# EAGLE design rev-tank-preamp (EAGLE 6.5.0)
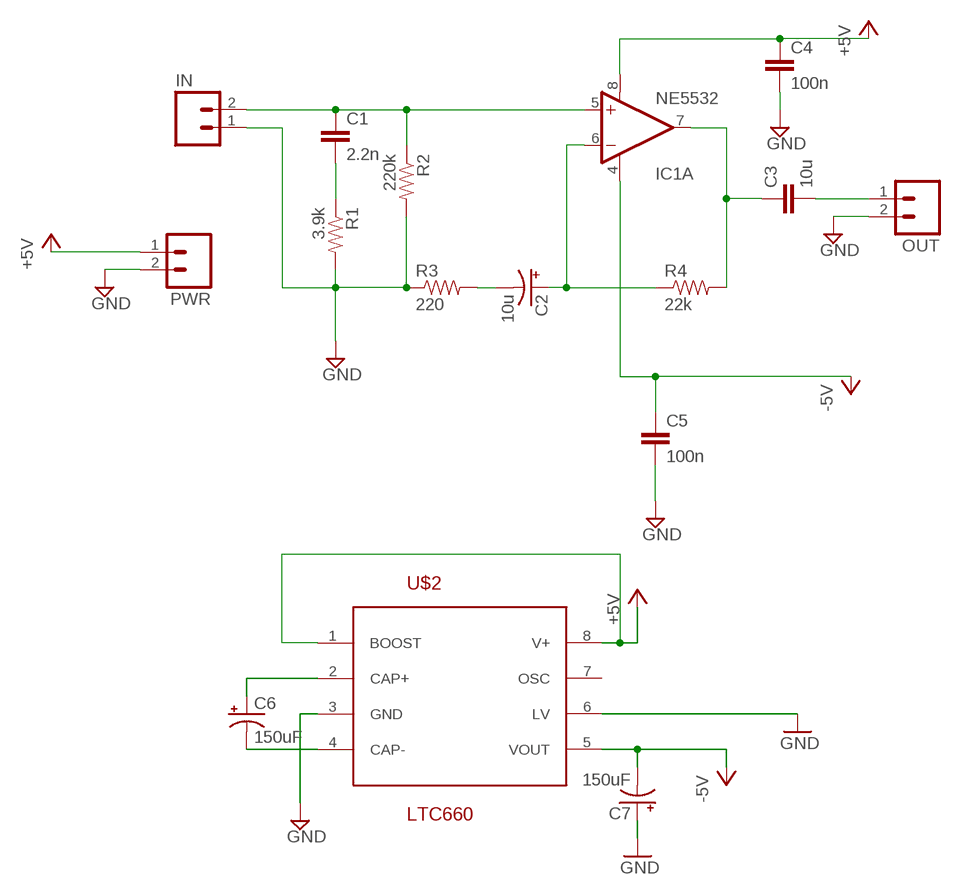
[diagram p0: schematic, sheet 1]

## Parts
C1  2.2n  CAPPTH1  [CAP-PTH-5MM]
C2  10u  CAP_POLPTH2  [CPOL-RADIAL-10UF-25V]
C3  10u  CAPPTH1  [CAP-PTH-5MM]
C4  100n  CAPPTH1  [CAP-PTH-5MM]
C5  100n  CAPPTH1  [CAP-PTH-5MM]
C6  150uF  CAP_POLPTH1  [CPOL-RADIAL-100UF-25V]
C7  150uF  CAP_POLPTH1  [CPOL-RADIAL-100UF-25V]
IC1  NE5532  OPAMP-DUALDIP  [DIP08]
IN  M02PTH  [1X02]
OUT  M02PTH  [1X02]
PWR  M02PTH  [1X02]
R1  3.9k  RESISTORPTH-1/6W  [1/6W-RES]
R2  220k  RESISTORPTH-1/6W  [1/6W-RES]
R3  220  RESISTORPTH-1/6W  [1/6W-RES]
R4  22k  RESISTORPTH-1/6W  [1/6W-RES]
U$2  LTC660  [SO08]

## Nets
+5V: C4.1 IC1.8(A:V+) PWR.1 U$2.1(BOOST) U$2.8(V+)
-5V: C5.1 C7.2(-) IC1.4(A:V-) U$2.5(VOUT)
GND: C4.2 C5.2 C7.1(+) IN.1 OUT.2 PWR.2 R1.2 R2.2 R3.1 U$2.3(GND) U$2.6(LV)
N$1: C1.1 IC1.5(A:+IN) IN.2 R2.1
N$2: C1.2 R1.1
N$3: C6.1(+) U$2.2(CAP+)
N$4: C2.1(+) IC1.6(A:-IN) R4.1
N$5: C2.2(-) R3.2
N$6: C3.2 OUT.1
N$7: C6.2(-) U$2.4(CAP-)
N$8: C3.1 IC1.7(A:OUT) R4.2
Unconnected: IC1.1(B:+IN) IC1.2(B:-IN) IC1.3(B:OUT) U$2.7(OSC)

## Library data of the parts
C1 C3-C5 = SparkFun:CAP: Capacitor Standard 0603 ceramic capacitor, and 0.1" leaded capacitor.
C2 C6 C7 = SparkFun:CAP_POL: Capacitor Polarized These are standard SMD and PTH capacitors. Normally 10uF, 47uF, and 100uF in electrolytic and tantalum varieties. Always verify the external diameter of the through hole cap, it varies with capacity, voltage, and manufacturer. The EIA devices should be standard.
IC1 = aliEagleLib:OPAMP-DUAL: Operational Amplifier
IN OUT PWR = SparkFun:M02: Header 2 Standard 2-pin 0.1" header. Use with straight break away headers (SKU : PRT-00116), right angle break away headers (PRT-00553), swiss pins (PRT-00743), machine pins (PRT-00117), and female headers (PRT-00115). Molex polarized connector foot print use with SKU : PRT-08233 with associated crimp pins and housings.
R1-R4 = SparkFun:RESISTOR: Resistor Basic schematic elements and footprints for 0603, 1206, and PTH resistors.
U$2 = Rays:LTC660

## Net classes
0 default: width 0.152 mm, clearance 0.152 mm

## Board
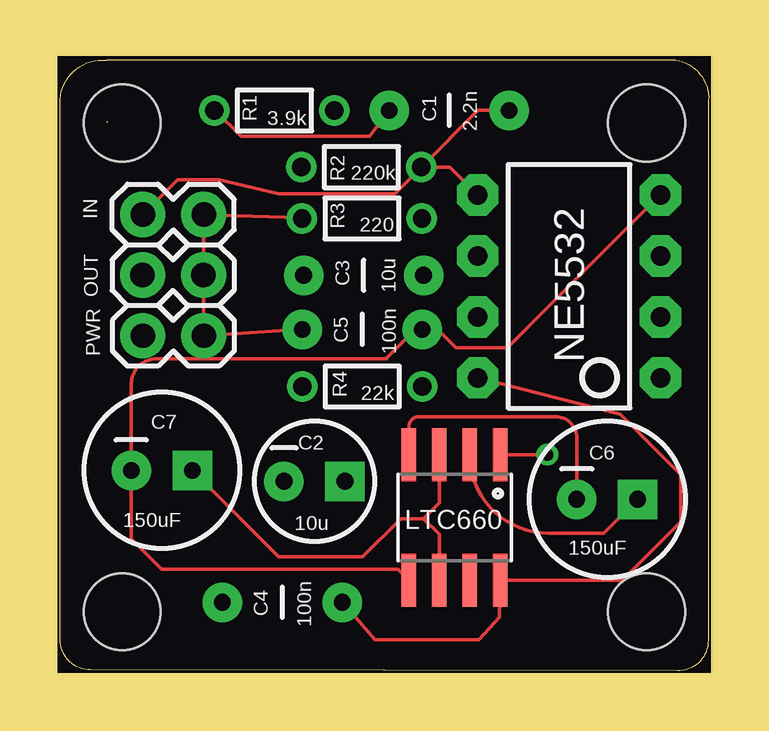
[diagram p1: board, top side]
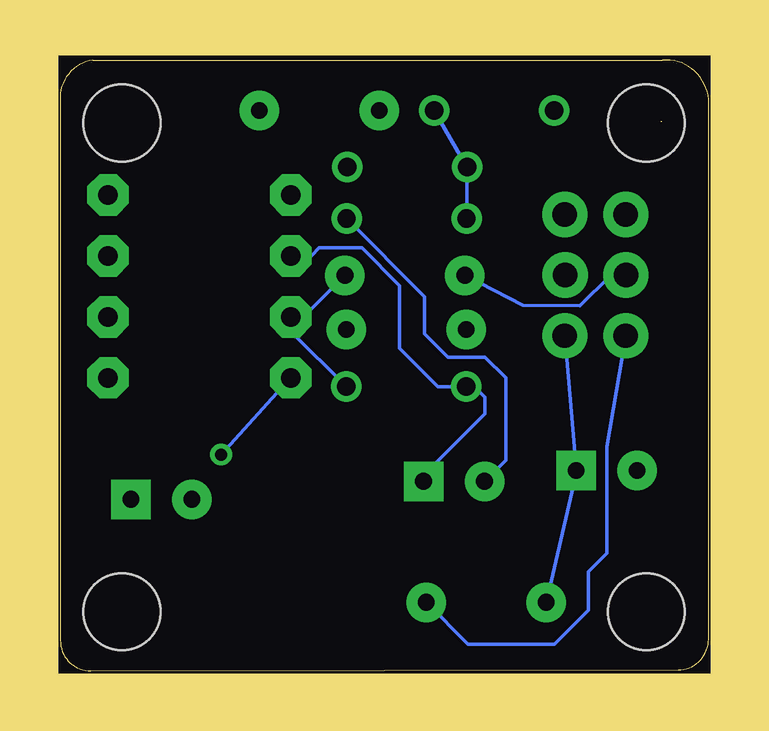
[diagram p2: board, bottom side, seen from below]

Size 27.04 x 25.46 mm. Coordinates in mm from the lower left corner, seen from the top.
Outline: 1.96,22.89 1.98,22.89
Outline: 25.68,25.45 1.93,25.45 arc90 0,23.82 0,1.32 arc90 1.27,0.05 25.76,0 arc90 27.03,1.27 27.03,23.62 arc90 25.68,25.45
Copper layers (1*16): Top 0.035mm / dielectric 1.5mm / Bottom 0.035mm
Design rules "default *": minimum track width 6mil, minimum drill 24mil, track to track 6mil, track to pad 6mil, pad to pad 6mil, via to via 6mil, smd to smd 6mil, copper to edge 0mil, drill to drill 8mil, minimum pad ring 10mil, minimum via ring 8mil, stop-mask expansion 4mil, vias tented up to drill 0mil, thermal gap 10mil
Holes 3.2 mm at 24.46,2.46 2.59,22.83 2.59,2.46 24.46,22.83
Milling: 4 lines

### Footprints (pad centres in the part's own frame; a part is rotated, then mirrored left to right if it is on the bottom)
CAP-PTH-5MM = drill 0.7 pad 1.651: 1 -2.5,0; 2 2.5,0
CPOL-RADIAL-10UF-25V = drill 0.7 pad 1.651 square: 1 1.27,0 | drill 0.7 pad 1.651: 2 -1.27,0
CPOL-RADIAL-100UF-25V = drill 0.7 pad 1.651 square: 1 1.27,0 | drill 0.7 pad 1.651: 2 -1.27,0
DIP08 = drill 0.813 pad 1.727 octagon: 1 -3.81,-3.81; 2 -1.27,-3.81; 3 1.27,-3.81; 4 3.81,-3.81; 5 3.81,3.81; 6 1.27,3.81; 7 -1.27,3.81; 8 -3.81,3.81
1X02 = drill 1.016 pad 1.88: 1 0,0; 2 2.54,0
1/6W-RES = drill 0.762: 1 -2.5,0; 2 2.5,0
SO08 = smd 0.61 x 2.21: 1 -1.905,-2.616; 2 -0.635,-2.616; 3 0.635,-2.616; 4 1.905,-2.616; 5 1.905,2.616; 6 0.635,2.616; 7 -0.635,2.616; 8 -1.905,2.616

### Placement (x,y rotation side)
C1  16.23,23.36 180 top
C2  10.61,7.9 0 top
C3  12.66,16.48 180 top
C4  9.27,2.86 180 top
C5  12.6,14.23 180 top
C6  22.82,7.15 0 top
C7  4.25,8.36 0 top
IC1  21.23,16.03 90 top
IN  5.99,19.02 180 top
OUT  3.44,16.5 0 top
PWR  3.45,13.97 0 top
R1  8.94,23.36 0 top
R2  12.57,20.99 180 top
R3  12.59,18.85 0 top
R4  12.6,11.85 0 top
U$2  16.45,6.4 180 top

### Tracks (layer width: path | path; a pad name or v marks a point on that pad's centre or on a via)
+5V  (via drill 0.5 pad 0.25)
  Top 0.152: C4.1 13.13,1.29 17.47,1.29 18.33,2.23 U$2.8 23.44,3.79 25.88,6.22 25.88,8.18 23.37,10.69 IC1.8 | v20.32,9.02 U$2.1
  Bottom 0.152: C4.1 10.03,1.12 6.43,1.12 5,2.54 5,4.14 4.24,4.91 4.24,9.35 PWR.1 | IC1.8 v20.32,9.02
-5V
  Top 0.152: IC1.4 18.66,13.46 16.51,13.46 15.74,14.23 C5.1 14.81,14.23 13.61,13.03 arc-90 13.59,13.01 4.01,13.01 arc90 2.98,11.97 C7.2 2.98,5.5 4.24,4.24 14.09,4.24 U$2.5
GND  (via drill 0.6)
  Top 0.152: U$2.6 15.82,5.7 15.16,6.35 | 15.16,6.35 14.22,6.35 12.62,4.75 9.12,4.75 C7.1 | U$2.3 15.82,7 15.16,6.35 | v10.07,18.88 IN.1 OUT.2 5.98,13.98 PWR.2 C5.2
  Bottom 0.152: R1.2 R2.2 v10.07,18.88 R3.1 | C4.2 5.5,8.34 C7.1 PWR.2
N$1
  Top 0.152: R2.1 16.26,20.99 IC1.5 | C1.1 17.43,23.36 R2.1 | IN.2 4.9,20.47 6.63,20.47 9.12,19.89 13.96,19.89 R2.1
N$2
  Top 0.152: R1.1 7.55,22.28 12.9,22.28 C1.2
N$3
  Top 0.152: C6.1 22.68,5.74 20.36,5.74 arc-90 U$2.2
N$4
  Bottom 0.152: IC1.6 16.56,17.3 16.23,17.63 14.45,17.63 12.88,16.05 12.88,13.44 11.28,11.84 10.12,11.84 R4.1 9.77,11.85 9.32,11.4 9.32,10.72 11.88,8.16 C2.1
N$5
  Bottom 0.152: R3.2 11.84,15.6 11.84,14.05 10.87,13.08 9.32,13.08 8.46,12.22 8.46,8.78 C2.2
N$6
  Bottom 0.152: OUT.1 4.08,16.5 5.36,15.21 7.75,15.24 C3.2
N$7
  Top 0.152: U$2.4 14.55,10.18 arc-90 14.96,10.59 20.68,10.59 arc-90 21.55,9.72 C6.2
N$8
  Bottom 0.152: C3.1 16.89,14.76 IC1.7 17.42,14.16 R4.2